# EAGLE design kapcsoló (EAGLE 9.0.0)
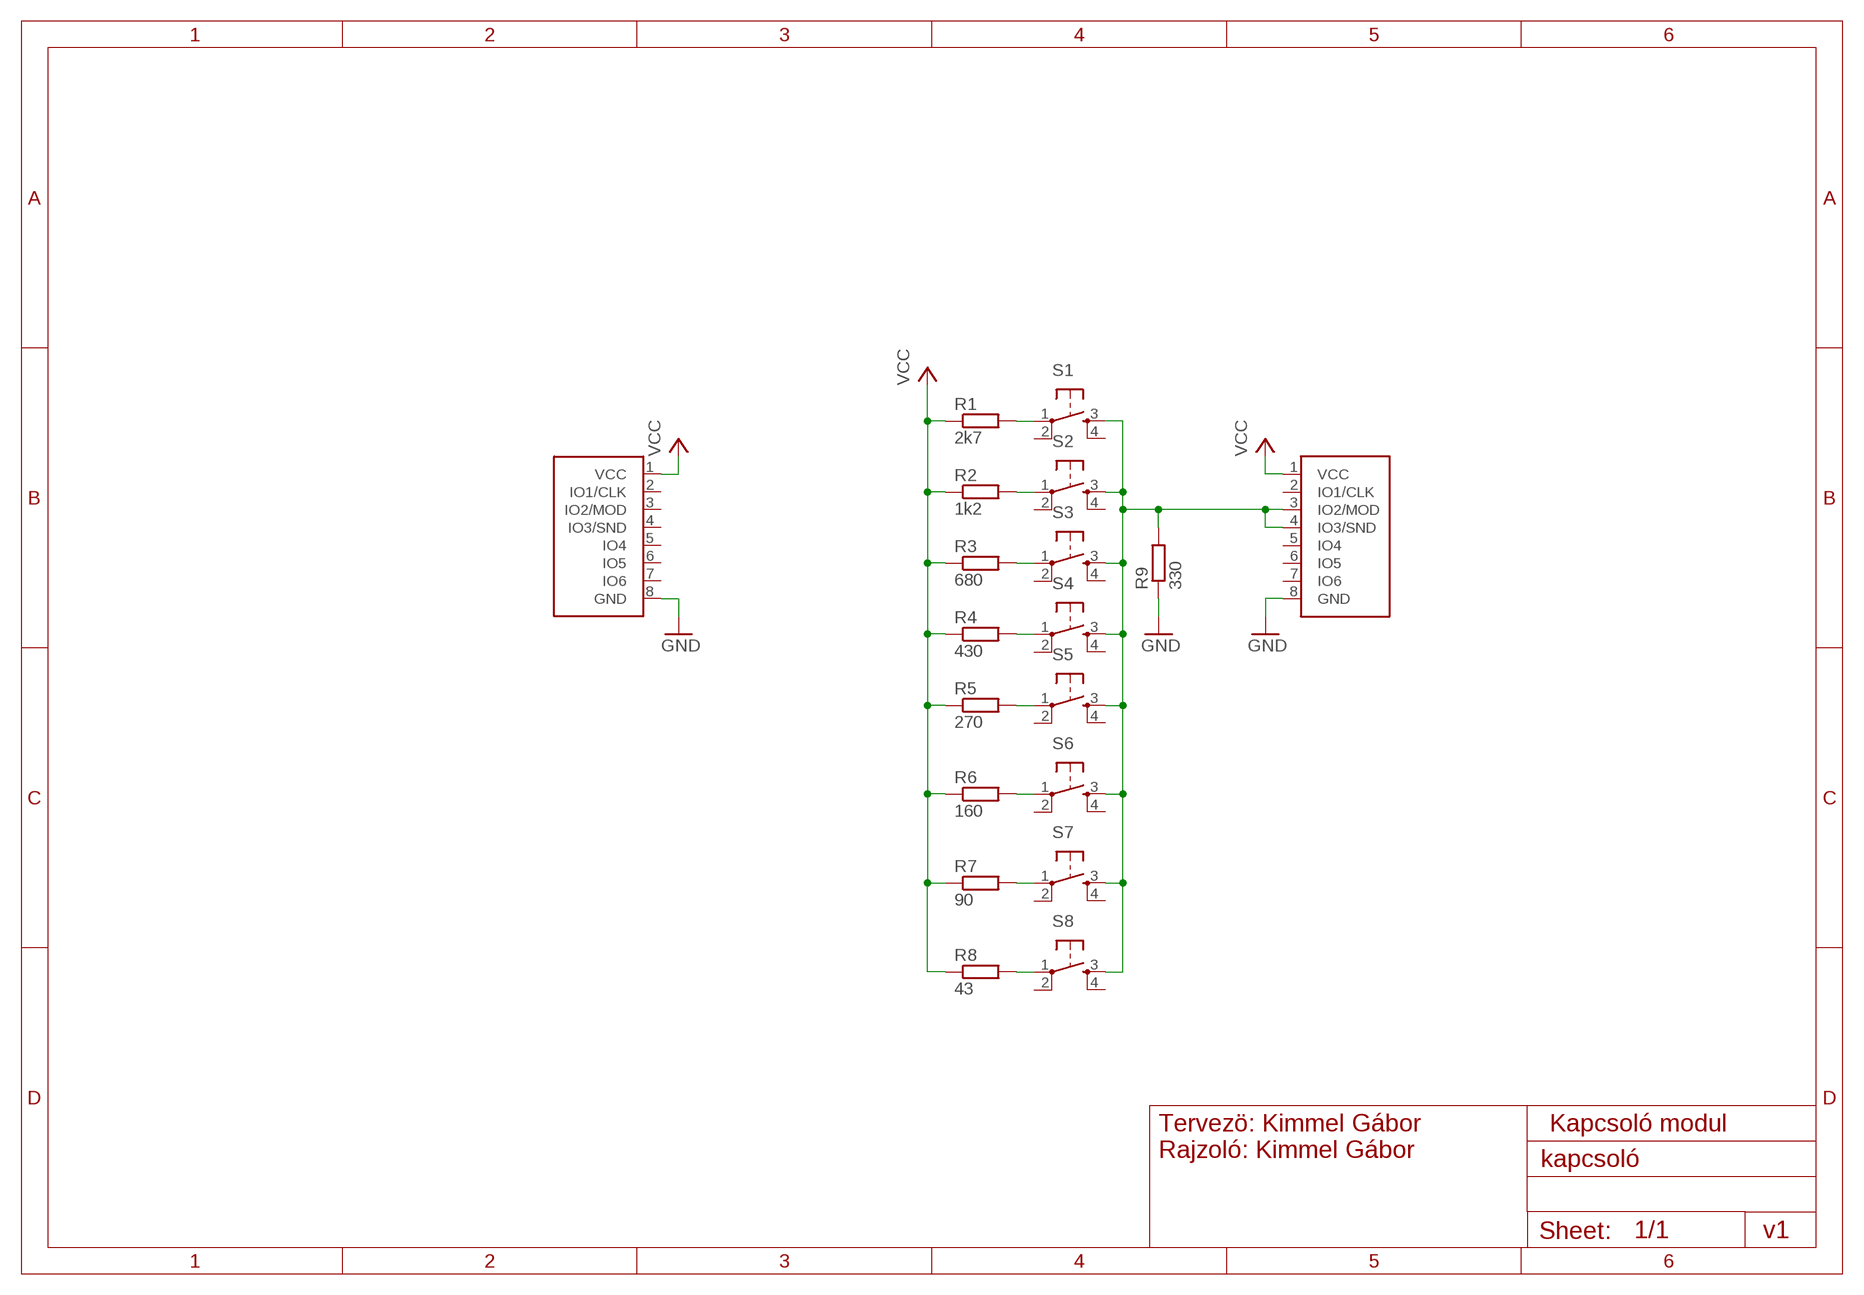
[diagram p0: schematic, sheet 1]

## Parts
R1  2k7  R-EU_0309/12  [0309/12]
R2  1k2  R-EU_0309/12  [0309/12]
R3  680  R-EU_0309/12  [0309/12]
R4  430  R-EU_0309/12  [0309/12]
R5  270  R-EU_0309/12  [0309/12]
R6  160  R-EU_0309/12  [0309/12]
R7  90  R-EU_0309/12  [0309/12]
R8  43  R-EU_0309/12  [0309/12]
R9  330  R-EU_0309/12  [0309/12]
S1  TAC_SWITCHPTH  [TACTILE-PTH]
S2  TAC_SWITCHPTH  [TACTILE-PTH]
S3  TAC_SWITCHPTH  [TACTILE-PTH]
S4  TAC_SWITCHPTH  [TACTILE-PTH]
S5  TAC_SWITCHPTH  [TACTILE-PTH]
S6  TAC_SWITCHPTH  [TACTILE-PTH]
S7  TAC_SWITCHPTH  [TACTILE-PTH]
S8  TAC_SWITCHPTH  [TACTILE-PTH]
U$1  GANZ-CONNECTOR-OUT  [MA08-1W]
U$2  GANZ-CONNECTOR  [FE08W]

## Nets
GND: R9.1 U$1.8(GND) U$2.8(GND)
N$1: R8.2 S8.1
N$2: R7.2 S7.1
N$3: R6.2 S6.1
N$4: R5.2 S5.1
N$5: R4.2 S4.1
N$6: R3.2 S3.1
N$7: R2.2 S2.1
N$8: R1.2 S1.1
N$9: R9.2 S1.3 S2.3 S3.3 S4.3 S5.3 S6.3 S7.3 S8.3 U$1.3(IO2/MOD) U$1.4(IO3/SND)
VCC: R1.1 R2.1 R3.1 R4.1 R5.1 R6.1 R7.1 R8.1 U$1.1(VCC) U$2.1(VCC)
Unconnected: S1.2 S1.4 S2.2 S2.4 S3.2 S3.4 S4.2 S4.4 S5.2 S5.4 S6.2 S6.4 S7.2 S7.4 S8.2 S8.4 U$1.2(IO1/CLK) U$1.5(IO4) U$1.6(IO5) U$1.7(IO6) U$2.2(IO1/CLK) U$2.3(IO2/MOD) U$2.4(IO3/SND) U$2.5(IO4) U$2.6(IO5) U$2.7(IO6)

## Notes on the sheet
- Tervezö: Kimmel Gábor
  Rajzoló: Kimmel Gábor
- Kapcsoló modul
- v1

## Library data of the parts
R1-R9 = resistor:R-EU_: RESISTOR, European symbol
S1-S8 = SparkFun-Electromechanical:TAC_SWITCH: Momentary Switch Button commonly used for reset or general input. Spark Fun Electronics SKU : COM-00097 SMT- SWCH-08247
U$1 = ganzlib:GANZ-CONNECTOR-OUT
U$2 = ganzlib:GANZ-CONNECTOR

## Board
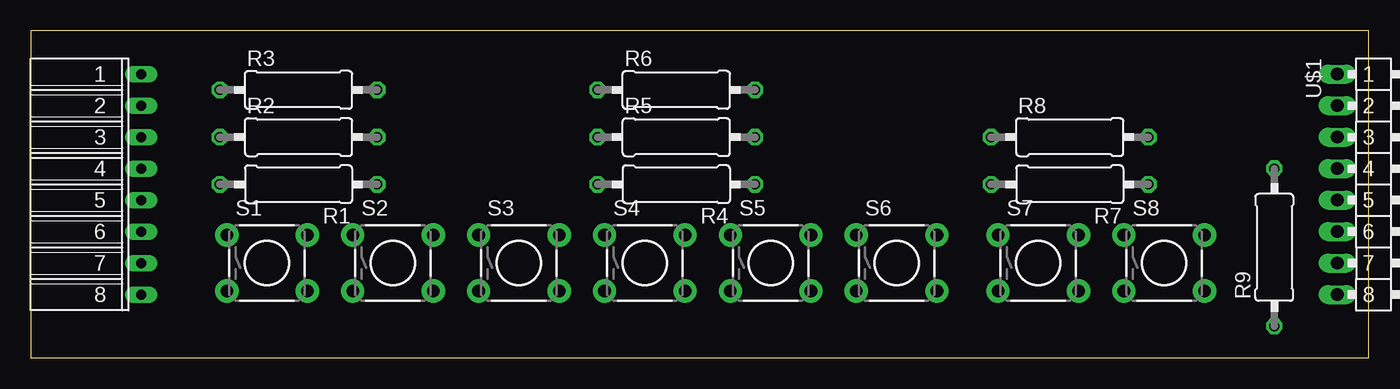
[diagram p1: board, top side]
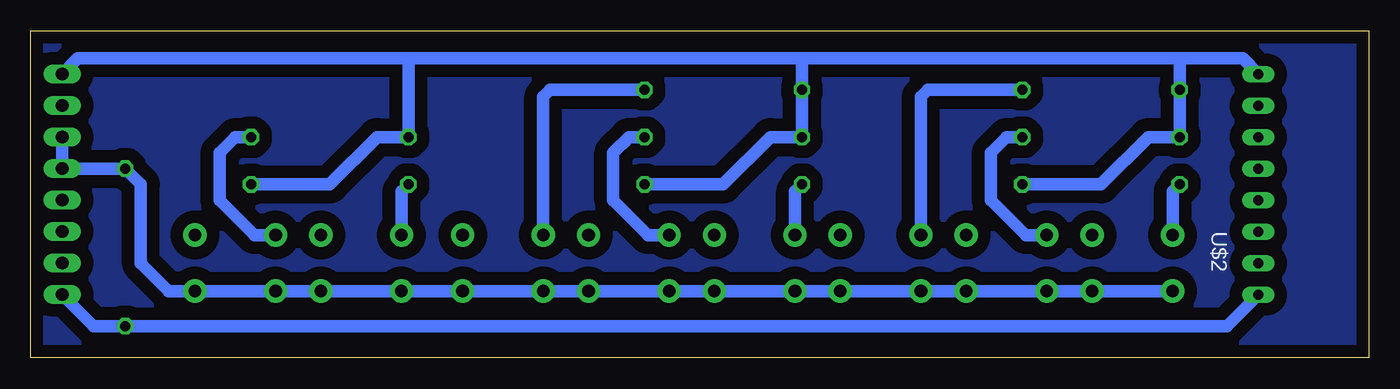
[diagram p2: board, bottom side, seen from below]

Size 107.93 x 26.34 mm. Coordinates in mm from the lower left corner, seen from the top.
Outline: 0,0 107.93,0 107.93,26.34 0,26.34 0,0
Copper layers (1*16): Top 0.035mm / dielectric 1.5mm / Bottom 0.035mm
Design rules "default *": minimum track width 10mil, minimum drill 24mil, track to track 8mil, track to pad 8mil, pad to pad 8mil, via to via 8mil, smd to smd 8mil, copper to edge 40mil, drill to drill 8mil, minimum pad ring 10mil, minimum via ring 8mil, stop-mask expansion 4mil, vias tented up to drill 0mil, thermal gap 10mil

### Footprints (pad centres in the part's own frame; a part is rotated, then mirrored left to right if it is on the bottom)
0309/12 = drill 0.813 octagon: 1 -6.35,0; 2 6.35,0
TACTILE-PTH = drill 1.016 pad 1.88: 1 -3.251,2.261; 2 3.251,2.261; 3 -3.251,-2.261; 4 3.251,-2.261
MA08-1W = drill 1.016 long: 1 0,8.89; 2 0,6.35; 3 0,3.81; 4 0,1.27; 5 0,-1.27; 6 0,-3.81; 7 0,-6.35; 8 0,-8.89
FE08W = drill 0.813 long: 1 5.08,8.89; 2 5.08,6.35; 3 5.08,3.81; 4 5.08,1.27; 5 5.08,-1.27; 6 5.08,-3.81; 7 5.08,-6.35; 8 5.08,-8.89

### Placement (x,y rotation side)
R1  21.59,13.97 180 top
R2  21.59,17.78 0 top
R3  21.59,21.59 0 top
R4  52.07,13.97 180 top
R5  52.07,17.78 0 top
R6  52.07,21.59 0 top
R7  83.82,13.97 180 top
R8  83.82,17.78 0 top
R9  100.33,8.89 90 top
S1  19.05,7.62 0 top
S2  29.21,7.62 0 top
S3  39.37,7.62 0 top
S4  49.53,7.62 0 top
S5  59.69,7.62 0 top
S6  69.85,7.62 0 top
S7  81.28,7.62 0 top
S8  91.44,7.62 0 top
U$1  105.41,13.97 0 top
U$2  3.81,13.97 0 top

### Tracks (layer width: path | path; a pad name or v marks a point on that pad's centre or on a via)
GND
  Bottom 1.016: U$2.8 11.43,2.54 R9.1 102.87,2.54 U$1.8
N$1
  Bottom 1.016: S8.1 89.89,9.88 92.71,12.7 92.71,16.51 91.44,17.78 R8.2
N$2
  Bottom 1.016: S7.1 78.03,13.41 R7.2
N$3
  Bottom 1.016: S6.1 66.6,21.03 66.04,21.59 R6.2
N$4
  Bottom 1.016: S5.1 58.14,9.88 60.96,12.7 60.96,16.51 59.69,17.78 R5.2
N$5
  Bottom 1.016: S4.1 46.28,13.41 R4.2
N$6
  Bottom 1.016: S3.1 36.12,21.03 35.56,21.59 R3.2
N$7
  Bottom 1.016: S2.1 27.66,9.88 30.48,12.7 30.48,16.51 29.21,17.78 R2.2
N$8
  Bottom 1.016: S1.1 15.8,13.41 R1.2
N$9
  Bottom 1.016: S1.3 S2.3 S3.3 S4.3 S5.3 S6.3 S7.3 S8.3 96.8,5.36 99.06,7.62 99.06,13.97 R9.2 U$1.4 U$1.3
N$10
  pour Bottom (isolate 1.016): 0,26.67 107.95,26.67 107.95,0 0,0
VCC
  Bottom 1.016: 15.24,24.13 45.72,24.13 | 45.72,24.13 77.47,24.13 | R1.1 21.59,13.97 17.78,17.78 R2.1 R3.1 15.24,24.13 | R6.1 R5.1 | R4.1 52.07,13.97 48.26,17.78 R5.1 | R7.1 83.82,13.97 80.01,17.78 R8.1 77.47,24.13 | R5.1 45.72,24.13 | 15.24,24.13 10.16,24.13 U$2.1 | 77.47,24.13 104.14,24.13 U$1.1